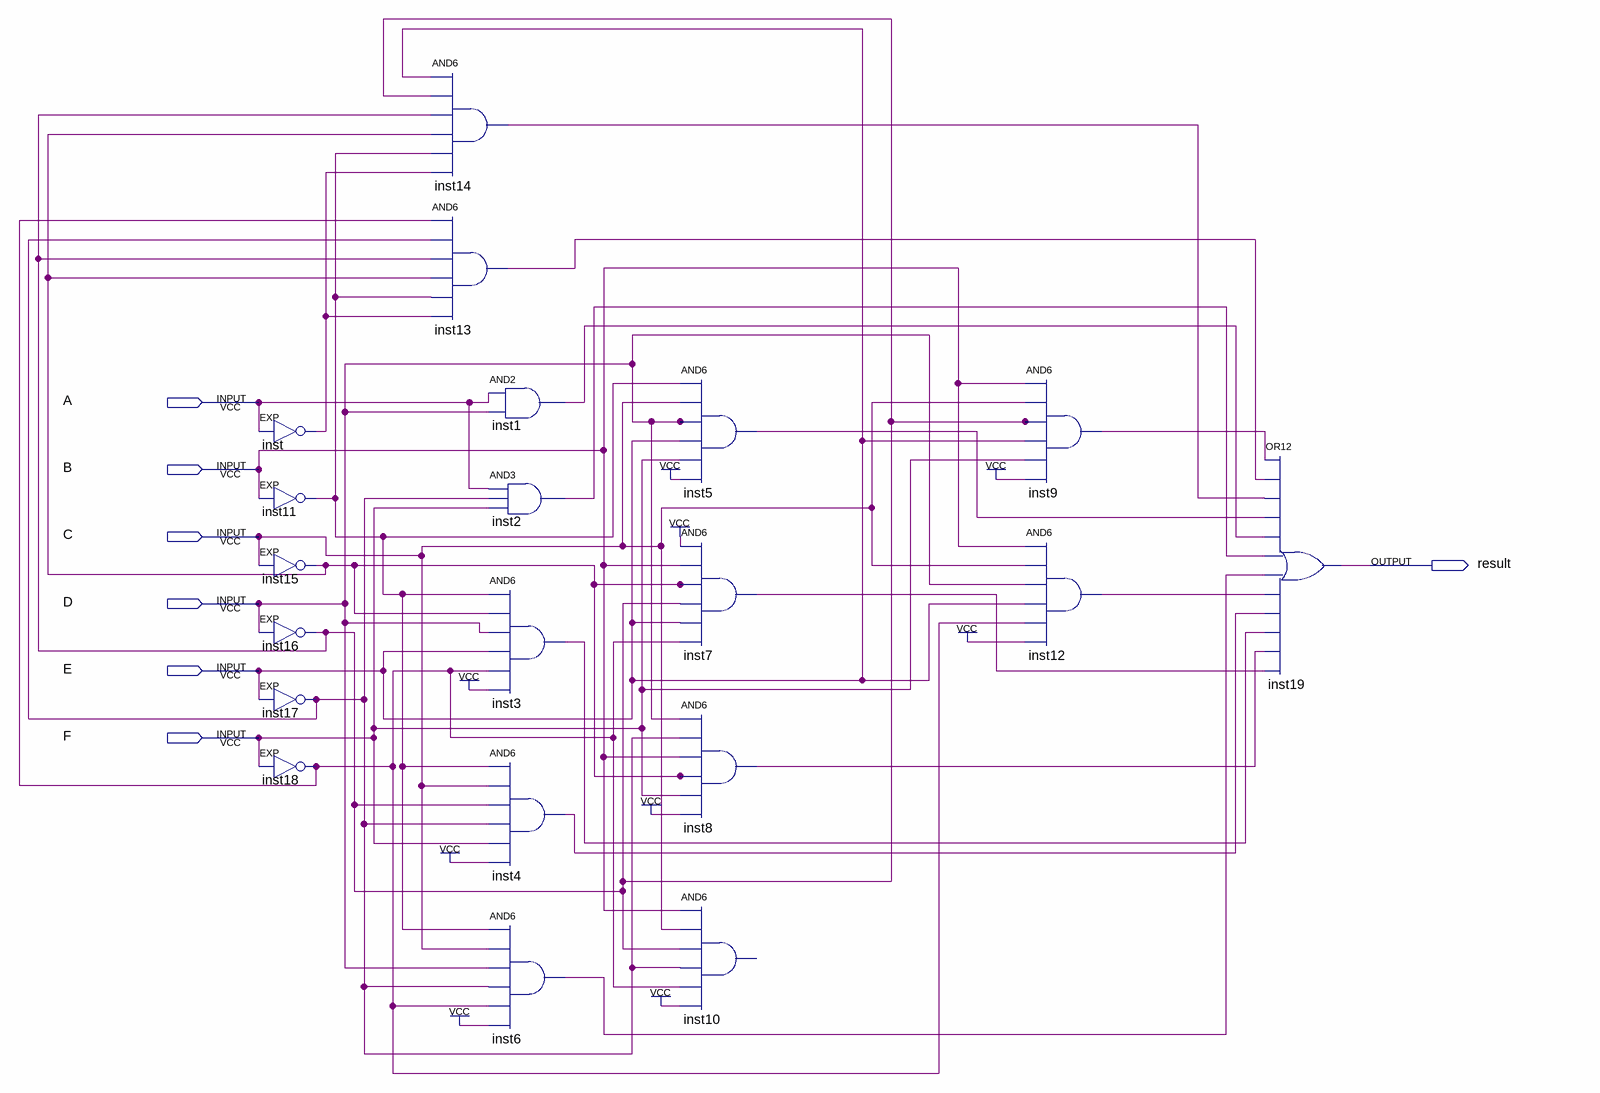
[diagram p0: schematic sheet]
// Quartus schematic isEqual.bdf as structural Verilog: 20 symbols, 7 pins
module isEqual (
  input  A,
  input  B,
  input  C,
  input  D,
  input  E,
  input  F,
  output result
);

  wire inst1_out, inst2_out, inst3_out, inst4_out, inst5_out, inst6_out, inst7_out, inst8_out, inst9_out,
       inst11_out, inst12_out, inst13_out, inst14_out, inst15_out, inst16_out, inst17_out, inst18_out,
       inst_out;

  EXP inst (.IN(A), .OUT(inst_out));
  EXP inst11 (.IN(B), .OUT(inst11_out));
  EXP inst15 (.IN(C), .OUT(inst15_out));
  EXP inst16 (.IN(D), .OUT(inst16_out));
  EXP inst17 (.IN(E), .OUT(inst17_out));
  EXP inst18 (.IN(F), .OUT(inst18_out));
  and inst14 (inst14_out, E, inst16_out, inst16_out, inst15_out, inst11_out, inst_out);
  and inst13 (inst13_out, inst18_out, inst17_out, inst16_out, inst15_out, inst11_out, inst_out);
  and inst1 (inst1_out, A, D);
  and inst2 (inst2_out, A, inst17_out, F);
  and inst3 (inst3_out, inst11_out, inst15_out, D, E, inst18_out, 1'b1);
  and inst4 (inst4_out, inst11_out, C, inst16_out, inst17_out, F, 1'b1);
  and inst6 (inst6_out, inst11_out, C, D, inst17_out, inst18_out, 1'b1);
  and inst5 (inst5_out, inst11_out, C, D, E, F, 1'b1);
  and inst7 (inst7_out, 1'b1, B, inst15_out, inst16_out, E, inst18_out);
  and inst8 (inst8_out, D, inst17_out, B, inst15_out, F, 1'b1);
  // AND6 inst10 has open pins: IN1=B, IN2=C, IN3=inst16_out, IN4=inst17_out, IN5=inst18_out, IN6=1'b1, OUT=open
  and inst9 (inst9_out, B, C, inst16_out, E, F, 1'b1);
  and inst12 (inst12_out, B, C, D, E, inst18_out, 1'b1);
  or inst19 (result, inst9_out, inst13_out, inst14_out, inst5_out, inst1_out, inst2_out, inst6_out, inst12_out, inst4_out, inst3_out, inst8_out, inst7_out);
endmodule
